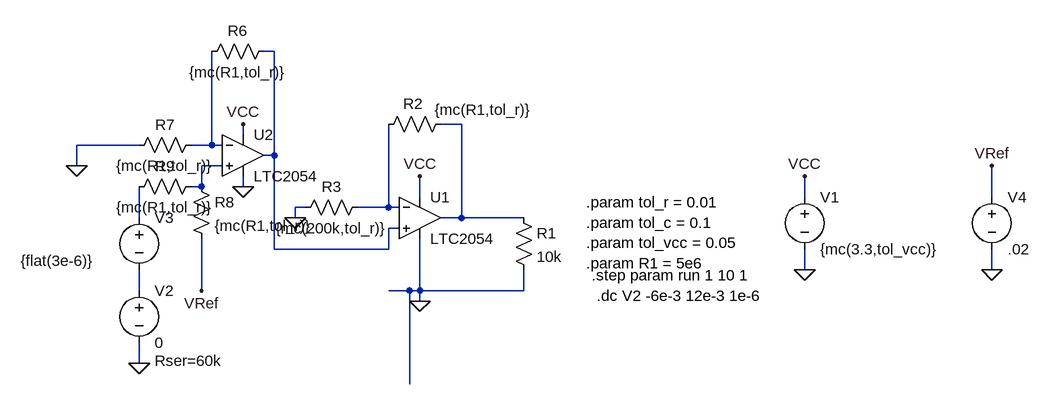
[diagram p0: schematic ThermopileAmp.asc]
ThermopileAmp.asc, the LTspice schematic file:
Version 4
SHEET 1 1160 680
WIRE -16 -80 -32 -80
WIRE 272 32 240 32
WIRE -64 48 -64 32
WIRE -224 64 -320 64
WIRE -112 64 -112 -80
WIRE -112 64 -144 64
WIRE -96 64 -112 64
WIRE -16 80 -16 -80
WIRE -16 80 -32 80
WIRE -320 96 -320 64
WIRE -96 96 -128 96
WIRE -128 128 -128 96
WIRE -128 128 -144 128
WIRE -64 128 -64 112
WIRE 208 144 208 112
WIRE 800 144 800 112
WIRE 1088 144 1088 96
WIRE 32 160 16 160
WIRE 160 160 160 32
WIRE 160 160 112 160
WIRE 176 160 160 160
WIRE -224 176 -224 128
WIRE 16 176 16 160
WIRE 272 176 272 32
WIRE 272 176 240 176
WIRE 368 176 272 176
WIRE 176 192 160 192
WIRE -16 224 -16 80
WIRE 160 224 160 192
WIRE 160 224 -16 224
WIRE 800 256 800 224
WIRE 1088 256 1088 224
WIRE -224 288 -224 256
WIRE -128 288 -128 208
WIRE 192 288 160 288
WIRE 208 288 208 208
WIRE 208 288 192 288
WIRE 368 288 368 256
WIRE 368 288 208 288
WIRE 208 304 208 288
WIRE -224 400 -224 368
WIRE 192 432 192 288
FLAG 208 304 0
FLAG 800 256 0
FLAG 800 112 VCC
FLAG 208 112 VCC
FLAG -224 400 0
FLAG 1088 256 0
FLAG 1088 96 VRef
FLAG -128 288 VRef
FLAG -64 128 0
FLAG -64 32 VCC
FLAG -320 96 0
FLAG 16 176 0
SYMBOL Opamps\\LTC2054 208 176 R0
SYMATTR InstName U1
SYMBOL voltage 800 128 R0
WINDOW 123 0 0 Left 2
WINDOW 39 0 0 Left 2
SYMATTR InstName V1
SYMATTR Value {mc(3.3,tol_vcc)}
SYMBOL res 352 160 R0
SYMATTR InstName R1
SYMATTR Value 10k
SYMBOL res 256 16 R90
WINDOW 0 0 58 VBottom 2
WINDOW 3 -22 -50 VTop 2
SYMATTR InstName R2
SYMATTR Value {mc(R1,tol_r)}
SYMBOL res 128 144 R90
WINDOW 0 0 56 VBottom 2
WINDOW 3 32 56 VTop 2
SYMATTR InstName R3
SYMATTR Value {mc(200k,tol_r)}
SYMBOL voltage -224 272 R0
WINDOW 123 0 0 Left 2
WINDOW 39 24 124 Left 2
SYMATTR SpiceLine Rser=60k
SYMATTR InstName V2
SYMATTR Value 0
SYMBOL voltage -224 160 R0
WINDOW 3 -182 82 Left 2
SYMATTR Value {flat(3e-6)}
SYMATTR InstName V3
SYMBOL voltage 1088 128 R0
WINDOW 123 0 0 Left 2
WINDOW 39 0 0 Left 2
SYMATTR InstName V4
SYMATTR Value .02
SYMBOL Opamps\\LTC2054 -64 80 R0
SYMATTR InstName U2
SYMBOL res -16 -96 R90
WINDOW 0 0 56 VBottom 2
WINDOW 3 32 56 VTop 2
SYMATTR InstName R6
SYMATTR Value {mc(R1,tol_r)}
SYMBOL res -128 48 R90
WINDOW 0 0 56 VBottom 2
WINDOW 3 32 56 VTop 2
SYMATTR InstName R7
SYMATTR Value {mc(R1,tol_r)}
SYMBOL res -144 112 R0
SYMATTR InstName R8
SYMATTR Value {mc(R1,tol_r)}
SYMBOL res -128 112 R90
WINDOW 0 0 56 VBottom 2
WINDOW 3 32 56 VTop 2
SYMATTR InstName R9
SYMATTR Value {mc(R1,tol_r)}
TEXT 464 152 Left 2 !.param tol_r = 0.01\n.param tol_c = 0.1\n.param tol_vcc = 0.05\n.param R1 = 5e6
TEXT 472 264 Left 2 !.step param run 1 10 1
TEXT 480 296 Left 2 !.dc V2 -6e-3 12e-3 1e-6

The netlist it stands for:
* ThermopileAmp.asc
XU1 N001 N005 N002 VCC 0 LTC2054  ; pins In+ In- OUT V+ V-
V1 VCC 0 {mc(3.3,tol_vcc)}
R1 N002 0 10k
R2 N002 N005 {mc(R1,tol_r)}
R3 N005 0 {mc(200k,tol_r)}
V2 N007 0 0 Rser=60k
V3 N006 N007 {flat(3e-6)}
V4 VRef 0 .02
XU2 N004 N003 N001 VCC 0 LTC2054  ; pins In+ In- OUT V+ V-
R6 N001 N003 {mc(R1,tol_r)}
R7 N003 0 {mc(R1,tol_r)}
R8 N004 VRef {mc(R1,tol_r)}
R9 N004 N006 {mc(R1,tol_r)}
.param tol_r = 0.01
.param tol_c = 0.1
.param tol_vcc = 0.05
.param R1 = 5e6
.step param run 1 10 1
.dc V2 -6e-3 12e-3 1e-6
.lib LTC2.lib
.backanno
.end